# EasyEDA Pro project ProPrj_Ozealis_2025-07-08.epro, schematic Schematic1
Board Name: Board1; Create Date: 2025-06-20; Page Name: P1; Project Name: Ozealis; Schematic Name: Schematic1; Update Date: 2025-06-23; Company: EasyEDA.com; Page Size: A4; Version: V1.0
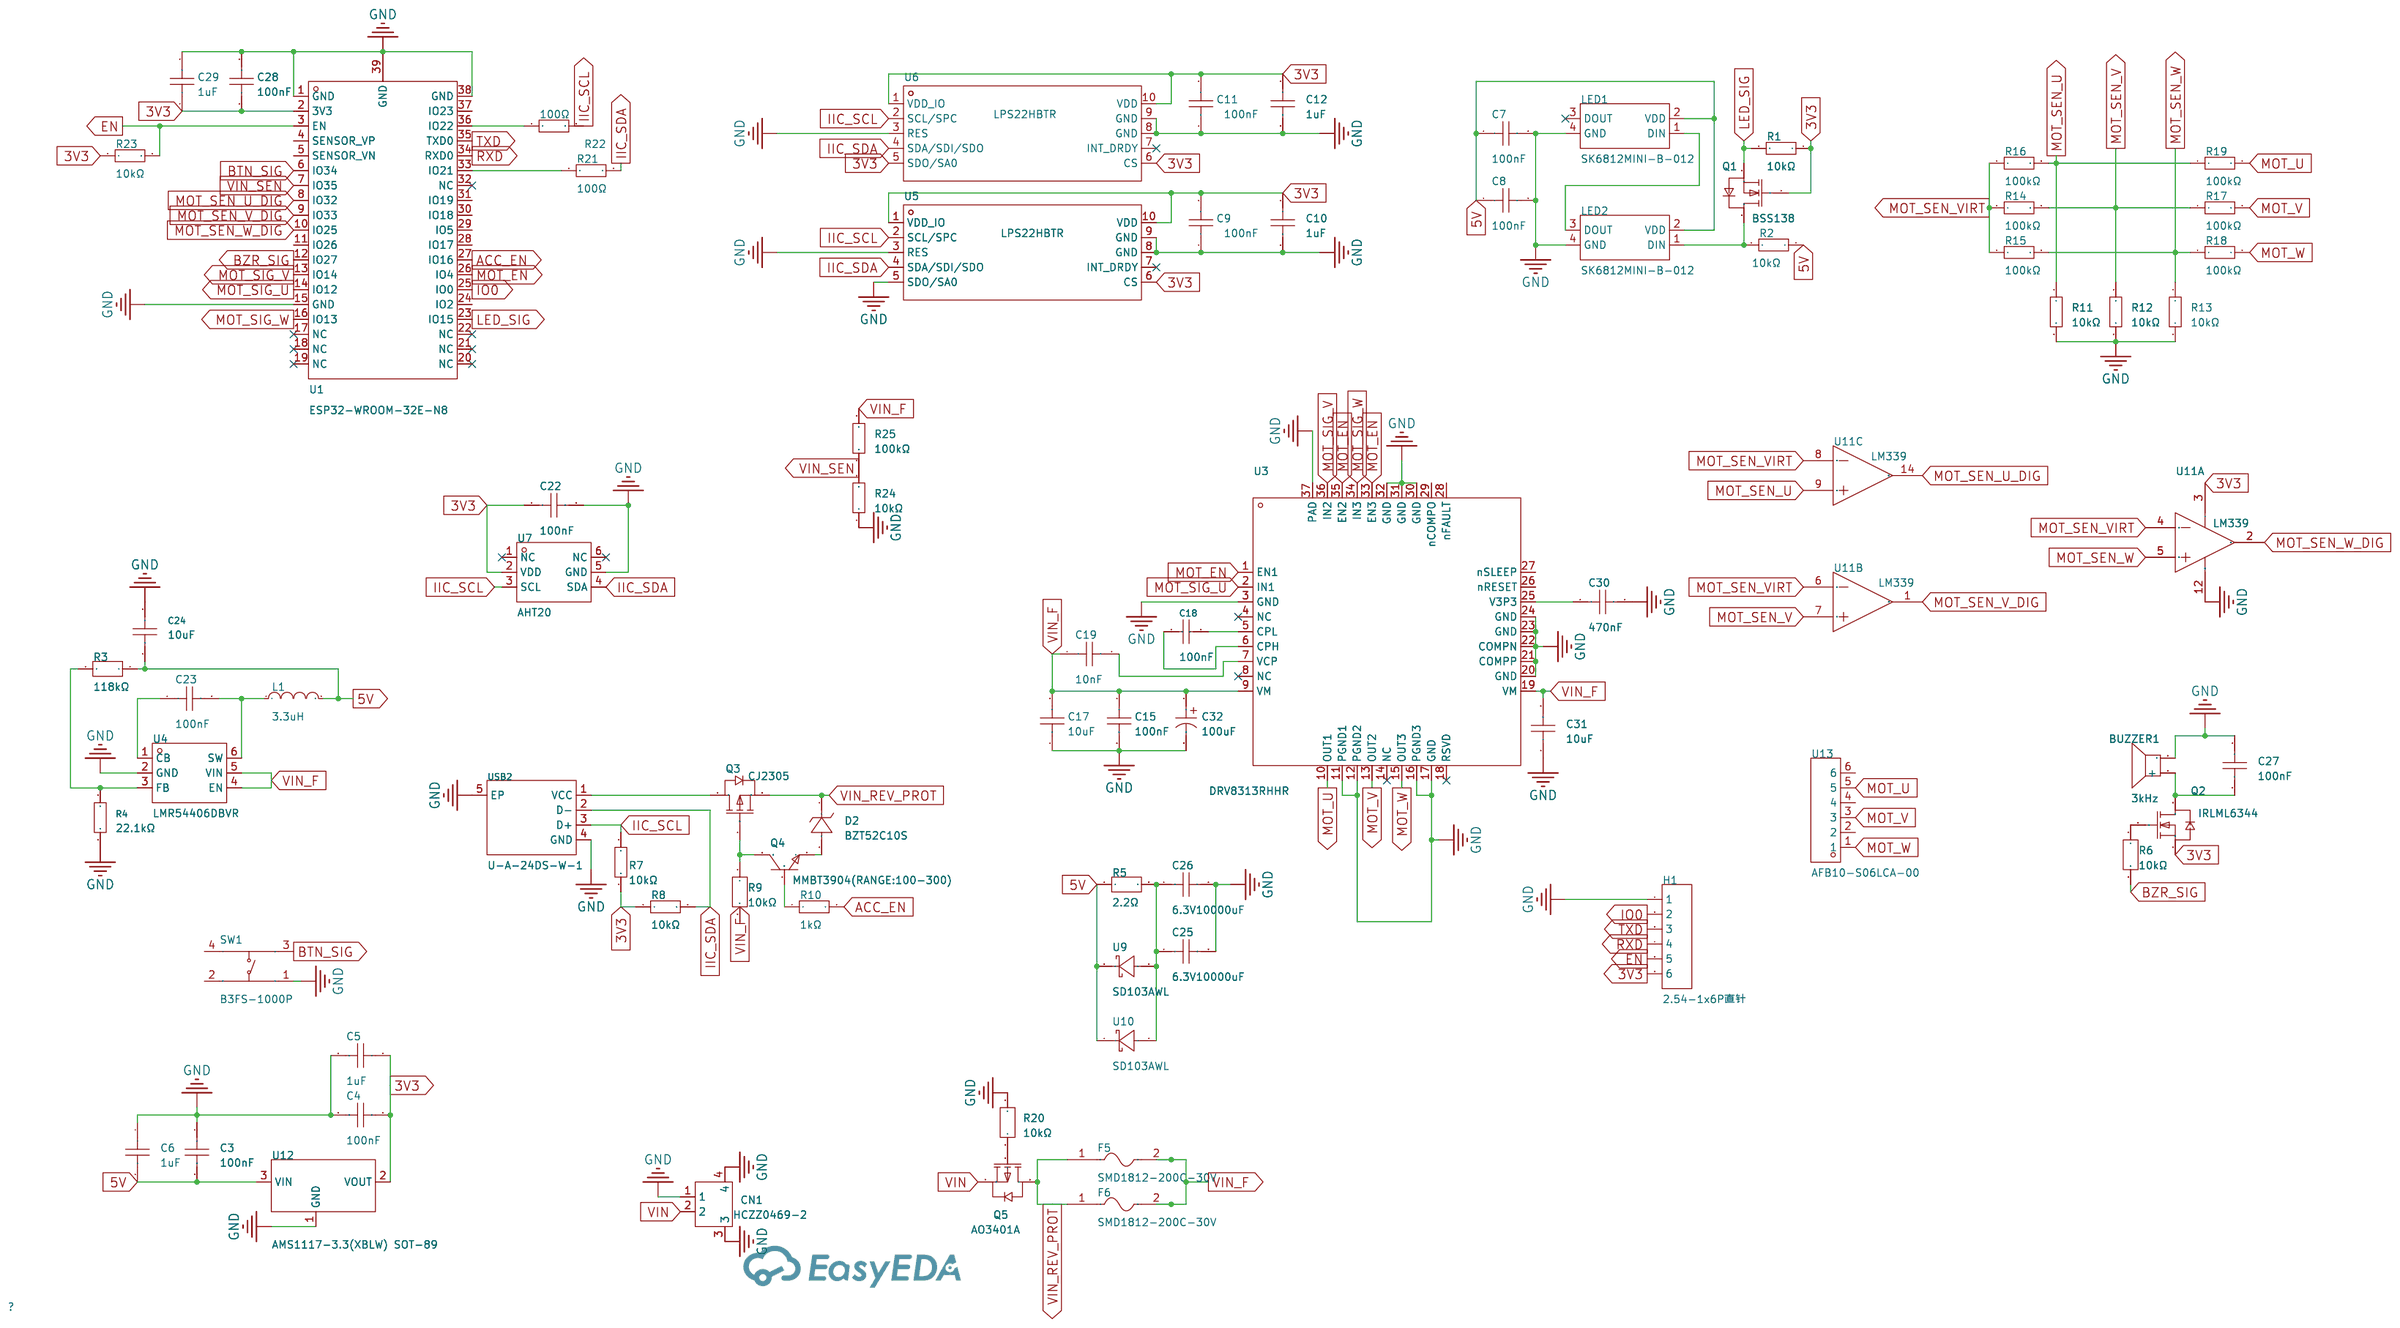
[diagram p0: schematic sheet]

## Parts
BUZZER1  3kHz  [BUZ-SMD_L9.6-W9.6-LS10.0-R]
C3  100nF  [C0603]
C4  100nF  [C0603]
C5  1uF  [C0603]
C6  1uF  [C0603]
C7  100nF  [C0603]
C8  100nF  [C0603]
C9  100nF  [C0603]
C10  1uF  [C0603]
C11  100nF  [C0603]
C12  1uF  [C0603]
C15  100nF  [C0603]
C17  10uF  [C0805]
C18  100nF  [C0603]
C19  10nF  [C0603]
C22  100nF  [C0603]
C23  100nF  [C0603]
C24  10uF  [C0603]
C25  6.3V10000uF  [PolCap_16x25mm]
C26  6.3V10000uF  [PolCap_16x25mm]
C27  100nF  [C0603]
C28  100nF  [C0603]
C29  1uF  [C0603]
C30  470nF  [C0603]
C31  10uF  [C0805]
C32  100uF  [CAP-SMD_BD6.3-L6.6-W6.6-LS7.4-FD]
CN1  HCZZ0469-2  [CONN-SMD_2P-P2.00_HCZZ0469-2]
D2  BZT52C10S  [SOD-323_L1.7-W1.3-LS2.6-RD]
F5  SMD1812-200C-30V  [F1812]
F6  SMD1812-200C-30V  [F1812]
H1  2.54-1x6P直针  [HDR-TH_6P-P2.54-V-M-1]
L1  3.3uH  [IND-SMD_L3.0-W3.0_FNR30XXS]
LED1  SK6812MINI-B-012  [LED-SMD_4P-L3.5-W3.5-R-SK6812MINI]
LED2  SK6812MINI-B-012  [LED-SMD_4P-L3.5-W3.5-R-SK6812MINI]
Q1  BSS138  [SOT-23-3_L2.9-W1.3-P1.90-LS2.4-BR-1]
Q2  IRLML6344  [SOT-23-3_L3.0-W1.7-P0.95-LS2.9-BR]
Q3  CJ2305  [SOT-23-3_L2.9-W1.3-P1.90-LS2.4-BR]
Q4  MMBT3904(RANGE:100-300)  [SOT-23-3_L2.9-W1.3-P1.90-LS2.4-BR]
Q5  AO3401A  [SOT-23_L2.9-W1.3-P1.90-LS2.4-BR]
R1  10kΩ  [R0603]
R2  10kΩ  [R0603]
R3  118kΩ  [R0402]
R4  22.1kΩ  [R0402]
R5  2.2Ω  [R0603]
R6  10kΩ  [R0603]
R7  10kΩ  [R0603]
R8  10kΩ  [R0603]
R9  10kΩ  [R0603]
R10  1kΩ  [R0603]
R11  10kΩ  [R0603]
R12  10kΩ  [R0603]
R13  10kΩ  [R0603]
R14  100kΩ  [R0603]
R15  100kΩ  [R0603]
R16  100kΩ  [R0603]
R17  100kΩ  [R0603]
R18  100kΩ  [R0603]
R19  100kΩ  [R0603]
R20  10kΩ  [R0603]
R21  100Ω  [R0603]
R22  100Ω  [R0603]
R23  10kΩ  [R0603]
R24  10kΩ  [R0603]
R25  100kΩ  [R0603]
SW1  B3FS-1000P  [KEY-SMD_4P-L6.0-W6.3-P4.50-LS8.0]
U1  ESP32-WROOM-32E-N8  [WIFI-SMD_ESP32-WROOM-32E]
U3  DRV8313RHHR  [VQFN-36_L6.0-W6.0-P0.50-TL-EP]
U4  LMR54406DBVR  [SOT-23-6_L2.9-W1.6-P0.95-LS2.8-BR]
U5  LPS22HBTR  [HLGA-10L_LPS22HBTR]
U6  LPS22HBTR  [HLGA-10L_LPS22HBTR]
U7  AHT20  [SENSOR-SMD_L3.0-W3.0-P1.00-BR]
U9  SD103AWL  [SOD-123FL_L2.8-W1.9-LS3.7-RD]
U10  SD103AWL  [SOD-123FL_L2.8-W1.9-LS3.7-RD]
U11  LM339  [SOIC-14_L8.7-W3.9-P1.27-LS6.0-BL]  (sections 1,2,3)
U12  AMS1117-3.3(XBLW) SOT-89  [SOT-89-3_L4.5-W2.5-P1.50-LS4.2-BR]
U13  AFB10-S06LCA-00  [FPC-SMD_6P-P1.00_AFB10-S6LCA-00]
USB2  U-A-24DS-W-1  [USB-A-SMD_U-A-24DS-W-1.]

## Library data of the parts
BUZZER1 = FUET-9650B-3V: Driver Circuitry:Active (Built-in Driver Circuit) Technology:Electromagnetic Type Voltage - Supply:2V~5V Voltage - Supply:2V~5V Frequency:3kHz Sound Pressure Level(SPL):85dB Length:9.6mm Width:9.6mm Height:5.5mm; LCSC Part Name: 电压 3V 频率 3KHZ; Supplier Part: C391032; Manufacturer: FUET(福声科技); Supplier Footprint: SMD,9.6x9.6mm; JLCPCB Part Class: Extended Part; Datasheet: https://atta.szlcsc.com/upload/public/pdf/source/20191031/C391032_DAAC75D3C9B9135EF0EA60697D179A21.pdf; Supplier: LCSC; Driver Circuitry: Active (Built-in Driver Circuit); Technology: Electromagnetic Type; Voltage - Supply: 2V~5V; Sound Pressure Level(SPL): 85dB; Length: 9.6mm; Width: 9.6mm; Height: 5.5mm
C3 C4 C7-C9 C11 C15 C18 C22 C23 C27 C28 = CC0603KRX7R9BB104: Capacitance:100nF Tolerance:±10% Tolerance:±10% Voltage Rating:50V Temperature Coefficient:X7R; LCSC Part Name: 100nF ±10% 50V; Supplier Part: C14663; Manufacturer: YAGEO(国巨); Supplier Footprint: 0603; JLCPCB Part Class: Basic Part; Datasheet: https://atta.szlcsc.com/upload/public/pdf/source/20180910/C282072_33301C7F631E79921B82A8DAC6BCC5B3.pdf; Supplier: LCSC; Tolerance: ±10%; Voltage Rating: 50V; Temperature Coefficient: X7R
C5 C6 C10 C12 C29 = CL10A105KB8NNNC: Capacitance: Tolerance:±10% Tolerance:±10% Voltage Rated: Temperature Coefficient:; LCSC Part Name: 1uF ±10% 50V; Supplier Part: C15849; Manufacturer: SAMSUNG(三星); Supplier Footprint: 0603; JLCPCB Part Class: Basic Part; Datasheet: https://atta.szlcsc.com/upload/public/pdf/source/20160218/1457707763339.pdf; Supplier: LCSC; Tolerance: ±10%
C17 C31 = GRM21BR61H106KE43L: Capacitance: Tolerance:±10% Tolerance:±10% Voltage Rated: Temperature Coefficient:; LCSC Part Name: 10uF ±10% 50V; Supplier Part: C440198; Manufacturer: muRata(村田); Supplier Footprint: 0805; JLCPCB Part Class: Basic Part; Datasheet: https://atta.szlcsc.com/upload/public/pdf/source/20230811/95AAE0C9AF55EDC31B7A4D8B733F534E.pdf; Supplier: LCSC; Tolerance: ±10%
C19 = 0603B103K500NT: Capacitance:10nF Tolerance:±10% Tolerance:±10% Voltage Rating:50V Temperature Coefficient:X7R; LCSC Part Name: 10nF ±10% 50V; Supplier Part: C57112; Manufacturer: FH(风华); Supplier Footprint: 0603; JLCPCB Part Class: Basic Part; Datasheet: https://atta.szlcsc.com/upload/public/pdf/source/20200305/C486355_26A10D38EF8C2A5C37091D0039909270.pdf; Supplier: LCSC; Tolerance: ±10%; Voltage Rating: 50V; Temperature Coefficient: X7R
C24 = TCC0603X5R106M6R3CT: Capacitance:10uF Tolerance:±20% Tolerance:±20% Voltage Rated: Temperature Coefficient:; LCSC Part Name: 10uF ±20% 6.3V; Supplier Part: C380318; Manufacturer: CCTC(三环); Supplier Footprint: 0603; JLCPCB Part Class: Extended Part; Datasheet: https://atta.szlcsc.com/upload/public/pdf/source/20191203/C466239_F62A586702D44EEA1C39B32FC8662B21.pdf; Supplier: LCSC; Tolerance: ±20%
C25 C26 = CAP_0603: Supplier Footprint: 0603
C30 = CL10B474KA8NNNC: Capacitance: Tolerance:±10% Tolerance:±10% Voltage Rated: Temperature Coefficient:; LCSC Part Name: 470nF ±10% 25V; Supplier Part: C1623; Manufacturer: SAMSUNG(三星); Supplier Footprint: 0603; JLCPCB Part Class: Basic Part; Datasheet: https://atta.szlcsc.com/upload/public/pdf/source/20160218/1457707763339.pdf; Supplier: LCSC; Tolerance: ±10%
C32 = RVT100UF35V67RV0034: Capacitance: Tolerance:±20% Tolerance:±20% Rated Voltage: Ripple Current:87mA@120kHz Equivalent Series Resistance(ESR):- φD: L: Lifetime @ Temp:2000hrs@105℃ Operating Temperature:-55℃~+105℃ Operating Temperature:-55℃~+105℃; LCSC Part Name: 100uF ±20% 35V; Supplier Part: C2836442; Manufacturer: KNSCHA(科尼盛); Supplier Footprint: SMD,D6.3xL7.7mm; JLCPCB Part Class: Extended Part; Datasheet: https://atta.szlcsc.com/upload/public/pdf/source/20210528/C2836442_7F6389BF36F63F32D6DF3A507E8E95D6.pdf; Supplier: LCSC; Tolerance: ±20%; Ripple Current: 87mA@120kHz; Lifetime @ Temp: 2000hrs@105℃; Operating Temperature: -55℃~+105℃
CN1 = HCZZ0469-2: Pins Structure:1x2P Pitch:2mm Mounting Type:Standing paste Reference Series:PH Number of Pins:2P Number of Rows:1 Number of PINs Per Row:2 Row Spacing:- Current Rating:- Contact Material:Copper Contact Plating:Tin Operating Temperature:-40℃~+85℃ Operating; LCSC Part Name: 米色 1x2P 间距:2mm 立贴加盖 系列:PH; Supplier Part: C7433663; Manufacturer: HC(虹成电子); Supplier Footprint: SMD,P=2mm; JLCPCB Part Class: Extended Part; Datasheet: https://atta.szlcsc.com/upload/public/pdf/source/20250106/BCCCD346ED2ED34F77424261D18F066D.pdf; Supplier: LCSC; Pins Structure: 1x2P; Pitch: 2mm; Mounting Type: Standing paste; Reference Series: PH; Number of Pins: 2P; Number of Rows: 1; Number of PINs Per Row: 2; Contact Material: Copper; Contact Plating: Tin; Operating Temperature: -40℃~+85℃; Voltage Rating: 200V; Plastic Material: LCP; Supplementary Features: Auxiliary soldering legs; Color: Beige; Z-Height of the Board: 6.8mm; X-Length of Bottom Edge on Board (Spacing Line): 8mm; Y-Width of Bottom Edge on Board: 7.45mm
D2 = BZT52C10S_C19077446: Diode Configuration:Independent Type Zener Voltage(Nom):10V Reverse Leakage Current (Ir):200nA@7V Zener Voltage(Range):9.4V~10.6V Zener Voltage(Range):9.4V~10.6V Pd - Power Dissipation(Pd):200mW Impedance(Zzt):20Ω; Supplier Part: C19077446; Manufacturer: 宏嘉诚; Supplier Footprint: SOD-323; JLCPCB Part Class: Extended Part; Datasheet: https://atta.szlcsc.com/upload/public/pdf/source/20250106/7E1D90346C4882705F28E5010261A625.pdf; Supplier: LCSC; Diode Configuration: Independent Type; Zener Voltage(Nom): 10V; Reverse Leakage Current (Ir): 200nA@7V; Zener Voltage(Range): 9.4V~10.6V; Pd - Power Dissipation(Pd): 200mW; Impedance(Zzt): 20Ω
F5 F6 = SMD1812-200C-30V: Voltage - Max:30V Current - Max:40A Hold Current:2A Trip Current:4A Power Dissipation:800mW Resistance - Initial (Ri) (Min):20mΩ Resistance - Post Trip (R1) (Max):120mΩ Time to Trip(Max):2s Operating Temperature:-40℃~+85℃ Operating Temperature:-40℃~+85℃; LCSC Part Name: 2A 30V; Supplier Part: C2760293; Manufacturer: BNstar(比诺星); Supplier Footprint: 1812; JLCPCB Part Class: Extended Part; Datasheet: https://atta.szlcsc.com/upload/public/pdf/source/20210406/C2760293_7ECBDC207E1EEA2298AB5DBB5FAFF113.pdf; Supplier: LCSC; Voltage - Max: 30V; Current - Max: 40A; Hold Current: 2A; Trip Current: 4A; Power Dissipation: 800mW; Resistance - Initial (Ri) (Min): 20mΩ; Resistance - Post Trip (R1) (Max): 120mΩ; Time to Trip(Max): 2s; Operating Temperature: -40℃~+85℃
H1 = 2.54-1x6P直针: Pin Structure:1x6P Pitch:2.54mm Row Spacing:- Circluar Pins/Square Pins:Policy Mounting Type:Straight Number of Rows:Single Row Number of Pins:6P Current Rating:3A Voltage Rating (Max):- Length of Mating Pin:- Insulation Height:- Contact Material:Brass Co; LCSC Part Name: 1x6P 间距:2.54mm 方针 直插; Supplier Part: C37208; Manufacturer: BOOMELE(博穆精密); Supplier Footprint: 插件,P=2.54mm; JLCPCB Part Class: Extended Part; Datasheet: https://atta.szlcsc.com/upload/public/pdf/source/20250115/42A019761A40C8B839643401D8CA5A96.pdf; Supplier: LCSC; Pin Structure: 1x6P; Pitch: 2.54mm; Circluar Pins/Square Pins: Policy; Mounting Type: Straight; Number of Rows: Single Row; Number of Pins: 6P; Current Rating: 3A; Contact Material: Brass; Operating Temperature: -40℃~+105℃; Color: Black
L1 = FNR3015S3R3MT: Inductance:3.3uH Tolerance:±20% Tolerance:±20% Current Rating:1.6A Current - Saturation(Isat):1.81A DC Resistance(DCR):104mΩ Type:Magnetic Core Shielded Winding Alloy Inductor; LCSC Part Name: 3.3uH ±20% 1.81A; Supplier Part: C167749; Manufacturer: cjiang(长江微电); Supplier Footprint: SMD,3x3mm; JLCPCB Part Class: Extended Part; Datasheet: https://atta.szlcsc.com/upload/public/pdf/source/20190327/C167925_9EFF0AABC4CA629C2CC95961DBF7D39D.pdf; Supplier: LCSC; Tolerance: ±20%; Current Rating: 1.6A; Current - Saturation(Isat): 1.81A; DC Resistance(DCR): 104mΩ; Type: Magnetic Core Shielded Winding Alloy Inductor
LED1 LED2 = SK6812MINI-B-012: Supplier Part: C5183448; Manufacturer: 欧思科光电; JLCPCB Part Class: Extended Part; Datasheet: https://atta.szlcsc.com/upload/public/pdf/source/20220921/A2A7EEE63CEE1C762C47FEA16B7D8FD1.pdf; Supplier: LCSC
Q1 = BSS138: Type:1 N-channel Drain Source Voltage (Vdss): Continuous Drain Current (Id): Drain Source On Resistance (RDS(on)@Vgs,Id):3.5Ω@4.5V,220mA Power Dissipation (Pd): Gate Threshold Voltage (Vgs(th)@Id):1.6V@1mA Total Gate Charge (Qg@Vgs):- Input Capacitance (C; LCSC Part Name: N沟道,电流:220mA,耐压:50V; Supplier Part: C3015220; Manufacturer: KUU; Supplier Footprint: SOT-23; JLCPCB Part Class: Extended Part; Datasheet: https://atta.szlcsc.com/upload/public/pdf/source/20220516/125DEF07DB3AB32C02C9AD402DEFFF8E.pdf; Supplier: LCSC; Type: 1 N-channel; Drain Source On Resistance (RDS(on)@Vgs,Id): 3.5Ω@4.5V,220mA; Gate Threshold Voltage (Vgs(th)@Id): 1.6V@1mA; Input Capacitance (Ciss@Vds): 50pF@25V; Operating Temperature: -55℃~+150℃
Q2 = IRLML6344: Type:1 N-channel Drain to Source Voltage:30V Current - Continuous Drain(Id):5A RDS(on):29mΩ@4.5V,5A Pd - Power Dissipation:1.3W Gate Threshold Voltage (Vgs(th)@Id):1.1V Gate Charge(Qg):6.8nC@4.5V Input Capacitance(Ciss@Vds):650pF@25V Reverse Transfer Capa; LCSC Part Name: 1个N沟道 耐压:30V 电流:5A; Supplier Part: C5364313; Manufacturer: Hottech(合科泰); Supplier Footprint: SOT-23; JLCPCB Part Class: Extended Part; Datasheet: https://atta.szlcsc.com/upload/public/pdf/source/20230301/8E25954CCFC2476B04CFE39BC51178A5.pdf; Supplier: LCSC; Type: 1 N-channel; Drain to Source Voltage: 30V; Current - Continuous Drain(Id): 5A; RDS(on): 29mΩ@4.5V,5A; Pd - Power Dissipation: 1.3W; Gate Threshold Voltage (Vgs(th)@Id): 1.1V; Gate Charge(Qg): 6.8nC@4.5V; Input Capacitance(Ciss@Vds): 650pF@25V; Reverse Transfer Capacitance (Crss@Vds): 46pF@15V; Operating Temperature: -55℃~+150℃
Q3 = CJ2305: Type:1 piece P-channel Drain to Source Voltage:12V Current - Continuous Drain(Id): RDS(on):90mΩ@1.8V,2A Pd - Power Dissipation:350mW Gate Threshold Voltage (Vgs(th)@Id):- Gate Charge(Qg):- Input Capacitance(Ciss@Vds):740pF@4V Reverse Transfer Capacitance; LCSC Part Name: 1个P沟道 耐压:12V 电流:4.1A; Supplier Part: C8549; Manufacturer: CJ(江苏长电/长晶); Supplier Footprint: SOT-23; JLCPCB Part Class: Extended Part; Datasheet: https://atta.szlcsc.com/upload/public/pdf/source/20161104/1478252660068.pdf; Supplier: LCSC; Type: 1 piece P-channel; Drain to Source Voltage: 12V; RDS(on): 90mΩ@1.8V,2A; Pd - Power Dissipation: 350mW; Input Capacitance(Ciss@Vds): 740pF@4V; Reverse Transfer Capacitance (Crss@Vds): 190pF@4V; Operating Temperature: -50℃~+150℃
Q4 = MMBT3904(RANGE:100-300): type:NPN Current - Collector(Ic): Collector - Emitter Voltage VCEO:40V Pd - Power Dissipation:200mW DC Current Gain:100@10mA,1V DC Current Gain:100@10mA,1V Transition frequency(fT):300MHz Current - Collector Cutoff:100nA Vce Saturation(VCE(sat)):300mV Ope; LCSC Part Name: hfe=100~300; Supplier Part: C20526; Manufacturer: CJ(江苏长电/长晶); Supplier Footprint: SOT-23; JLCPCB Part Class: Basic Part; Datasheet: https://atta.szlcsc.com/upload/public/pdf/source/20220704/70F575FB75061E03F919270A6BB8BA7F.pdf; Supplier: LCSC; type: NPN; Collector - Emitter Voltage VCEO: 40V; Pd - Power Dissipation: 200mW; DC Current Gain: 100@10mA,1V; Transition frequency(fT): 300MHz; Current - Collector Cutoff: 100nA; Vce Saturation(VCE(sat)): 300mV
Q5 = AO3401A_C347476: Type:1 Piece P-Channel Drain Source Voltage (Vdss): Continuous Drain Current (Id): Drain Source On Resistance (RDS(on)@Vgs,Id):50mΩ@10V Power Dissipation (Pd): Gate Threshold Voltage (Vgs(th)@Id):400mV@250uA Total Gate Charge (Qg@Vgs):9.4nC@4.5V Input Cap; LCSC Part Name: 1个P沟道 耐压:30V 电流:4.2A; Supplier Part: C347476; Manufacturer: UMW(友台半导体); Supplier Footprint: SOT-23; JLCPCB Part Class: Extended Part; Datasheet: https://atta.szlcsc.com/upload/public/pdf/source/20231109/42F312EBB081D72F04A7E8221BFFAF9D.pdf; Supplier: LCSC; Type: 1 Piece P-Channel; Drain Source On Resistance (RDS(on)@Vgs,Id): 50mΩ@10V; Gate Threshold Voltage (Vgs(th)@Id): 400mV@250uA; Total Gate Charge (Qg@Vgs): 9.4nC@4.5V; Input Capacitance (Ciss@Vds): 954pF; Reverse Transfer Capacitance (Crss@Vds): 77pF; Operating Temperature: -55℃~+150℃
R1 R2 R11-R13 = RC0603FR-0710KL: Type:Thick Film Resistors Resistance: Tolerance:±1% Tolerance:±1% Power(Watts): Overload Voltage (Max): Temperature Coefficient:±100ppm/℃ Temperature Coefficient:±100ppm/℃ Operating Temperature Range:-55℃~+155℃ Operating Temperature Range:-55℃~+155℃; LCSC Part Name: 厚膜电阻 10kΩ ±1% 100mW; Supplier Part: C98220; Manufacturer: YAGEO(国巨); Supplier Footprint: 0603; JLCPCB Part Class: Extended Part; Datasheet: https://atta.szlcsc.com/upload/public/pdf/source/20180927/C295883_E8D83085EA81BD7DE0B2B681138C15EE.pdf; Supplier: LCSC; Type: Thick Film Resistors; Tolerance: ±1%; Temperature Coefficient: ±100ppm/℃; Operating Temperature Range: -55℃~+155℃
R3 = RC0402FR-07118KL: Type:Thick Film Resistors Resistance: Tolerance:±1% Tolerance:±1% Power(Watts): Overload Voltage (Max): Temperature Coefficient:±100ppm/℃ Temperature Coefficient:±100ppm/℃ Operating Temperature Range:-55℃~+155℃ Operating Temperature Range:-55℃~+155℃; LCSC Part Name: 厚膜电阻 118kΩ ±1% 62.5mW; Supplier Part: C295873; Manufacturer: YAGEO(国巨); Supplier Footprint: 0402; JLCPCB Part Class: Extended Part; Datasheet: https://atta.szlcsc.com/upload/public/pdf/source/20191125/C364360_EA870FADD46A2AD4DBE56DD50D360B3E.pdf; Supplier: LCSC; Type: Thick Film Resistors; Tolerance: ±1%; Temperature Coefficient: ±100ppm/℃; Operating Temperature Range: -55℃~+155℃
R4 = RMC040222.1K1%N: Resistance: Tolerance:±1% Tolerance:±1% Power(Watts):; LCSC Part Name: 22.1kΩ ±1% 62.5mW; Supplier Part: C325588; Manufacturer: Tyohm(幸亚电阻); Supplier Footprint: 0402; JLCPCB Part Class: Extended Part; Datasheet: https://atta.szlcsc.com/upload/public/pdf/source/20190115/C325956_D27151D492FFB3C9AB4A6F14FE01F30A.pdf; Supplier: LCSC; Tolerance: ±1%
R5 = FRC0603J2R2TS: Type:Thick Film Resistors Resistance: Tolerance:±5% Tolerance:±5% Power(Watts): Overload Voltage (Max): Temperature Coefficient:±200ppm/℃ Temperature Coefficient:±200ppm/℃ Operating Temperature Range:-55℃~+155℃ Operating Temperature Range:-55℃~+155℃; LCSC Part Name: 2.2Ω ±5% 100mW 厚膜电阻; Supplier Part: C2930032; Manufacturer: FOJAN(富捷); Supplier Footprint: 0603; JLCPCB Part Class: Extended Part; Datasheet: https://atta.szlcsc.com/upload/public/pdf/source/20211221/925EC7D7225764EE0046F22065062C87.pdf; Supplier: LCSC; Type: Thick Film Resistors; Tolerance: ±5%; Temperature Coefficient: ±200ppm/℃; Operating Temperature Range: -55℃~+155℃
R6-R9 R20 R23 R24 = FRC0603J103 TS: Type:Thick Film Resistors Resistance:10kΩ Tolerance:±5% Tolerance:±5% Power(Watts):0.1W Voltage-Supply(Max):75V Temperature Coefficient:±100ppm/℃ Temperature Coefficient:±100ppm/℃ Operating Temperature:-55℃~+155℃ Operating Temperature:-55℃~+155℃; LCSC Part Name: 10kΩ ±5% 100mW 厚膜电阻; Supplier Part: C2930027; Manufacturer: FOJAN(富捷); Supplier Footprint: 0603; JLCPCB Part Class: Extended Part; Datasheet: https://atta.szlcsc.com/upload/public/pdf/source/20211221/925EC7D7225764EE0046F22065062C87.pdf; Supplier: LCSC; Type: Thick Film Resistors; Tolerance: ±5%; Power(Watts): 0.1W; Voltage-Supply(Max): 75V; Temperature Coefficient: ±100ppm/℃; Operating Temperature: -55℃~+155℃
R10 = 0603WAF1001T5E: Type:Thick Film Resistors Resistance:1kΩ Tolerance:±1% Tolerance:±1% Power(Watts): Overload Voltage (Max): Temperature Coefficient:±100ppm/℃ Temperature Coefficient:±100ppm/℃ Operating Temperature Range:-55℃~+155℃ Operating Temperature Range:-55℃~+155℃; LCSC Part Name: 1kΩ ±1% 100mW 厚膜电阻; Supplier Part: C21190; Manufacturer: UNI-ROYAL(厚声); Supplier Footprint: 0603; JLCPCB Part Class: Basic Part; Datasheet: https://atta.szlcsc.com/upload/public/pdf/source/20200306/C422600_1E6D84923E4A46A82E41ADD87F860B5C.pdf; Supplier: LCSC; Type: Thick Film Resistors; Tolerance: ±1%; Temperature Coefficient: ±100ppm/℃; Operating Temperature Range: -55℃~+155℃
R14-R19 R25 = 0603WAF1003T5E: Type:Thick Film Resistors Resistance:100kΩ Tolerance:±1% Tolerance:±1% Power(Watts): Overload Voltage (Max): Temperature Coefficient:±100ppm/℃ Temperature Coefficient:±100ppm/℃ Operating Temperature Range:-55℃~+155℃ Operating Temperature Range:-55℃~+155℃; LCSC Part Name: 100kΩ ±1% 100mW 厚膜电阻; Supplier Part: C25803; Manufacturer: UNI-ROYAL(厚声); Supplier Footprint: 0603; JLCPCB Part Class: Basic Part; Datasheet: https://atta.szlcsc.com/upload/public/pdf/source/20200306/C422600_1E6D84923E4A46A82E41ADD87F860B5C.pdf; Supplier: LCSC; Type: Thick Film Resistors; Tolerance: ±1%; Temperature Coefficient: ±100ppm/℃; Operating Temperature Range: -55℃~+155℃
R21 R22 = 0603WAF1000T5E: Type:Thick Film Resistors Resistance: Tolerance:±1% Tolerance:±1% Power(Watts): Overload Voltage (Max): Temperature Coefficient:±200ppm/℃ Temperature Coefficient:±200ppm/℃ Operating Temperature Range:-55℃~+155℃ Operating Temperature Range:-55℃~+155℃; LCSC Part Name: 100Ω ±1% 100mW 厚膜电阻; Supplier Part: C22775; Manufacturer: UNI-ROYAL(厚声); Supplier Footprint: 0603; JLCPCB Part Class: Basic Part; Datasheet: https://atta.szlcsc.com/upload/public/pdf/source/20200306/C422600_1E6D84923E4A46A82E41ADD87F860B5C.pdf; Supplier: LCSC; Type: Thick Film Resistors; Tolerance: ±1%; Temperature Coefficient: ±200ppm/℃; Operating Temperature Range: -55℃~+155℃
SW1 = B3FS-1000P: Circuit:SPST Actuator Style:Round Button Operating Force:100gf Mounting Style:Standing paste Switch Length:6.3mm Switch Width:6mm Switch Height:3.1mm Contact Current:50mA Voltage Rating (DC):24V With Lamp:- Pin Style:Gullwing Mechanical Life:- Operating T; LCSC Part Name: 6.3*6*3.1mm 立贴 轻触开关; Supplier Part: C271750; Manufacturer: OMRON(欧姆龙); Supplier Footprint: SMD,6x6mm; JLCPCB Part Class: Extended Part; Supplier: LCSC; Circuit: SPST; Actuator Style: Round Button; Operating Force: 100gf; Mounting Style: Standing paste; Switch Length: 6.3mm; Switch Width: 6mm; Switch Height: 3.1mm; Contact Current: 50mA; Voltage Rating (DC): 24V; Pin Style: Gullwing; Operating Temperature: -25℃~+70℃
U1 = ESP32-WROOM-32E-N8: LCSC Part Name: 通用型Wi-Fi+BT+BLE MCU模组; Supplier Part: C701342; Manufacturer: ESPRESSIF(乐鑫); Supplier Footprint: SMD,18x25.5mm; JLCPCB Part Class: Extended Part; Datasheet: https://atta.szlcsc.com/upload/public/pdf/source/20240307/DEBA00FAE5BA634F0D73085E4F214E93.pdf; Supplier: LCSC
U3 = DRV8313RHHR: LCSC Part Name: 无刷直流BLDC电机驱动芯片 60V; Supplier Part: C165154; Manufacturer: TI(德州仪器); Supplier Footprint: VQFN-36-EP(6x6); JLCPCB Part Class: Extended Part; Datasheet: https://www.ti.com/cn/lit/gpn/drv8313; Supplier: LCSC
U4 = LMR54406DBVR: Function:Step-down type Output Type:Adjustable Input Voltage:4V~36V Input Voltage:4V~36V Output Voltage:1V~28V Output Voltage:1V~28V Output Current:600mA Switching Frequency:1265kHz Switching Frequency:1265kHz Operating Temperature:-40℃~+125℃ Operating Te; Supplier Part: C5219316; Manufacturer: TI(德州仪器); Supplier Footprint: SOT-23-6; JLCPCB Part Class: Extended Part; Datasheet: https://www.ti.com/cn/lit/gpn/lmr54410; Supplier: LCSC; Function: Step-down type; Output Type: Adjustable; Input Voltage: 4V~36V; Output Voltage: 1V~28V; Output Current: 600mA; Switching Frequency: 1265kHz; Operating Temperature: -40℃~+125℃; Synchronous Rectification: Yes; Number of Outputs: 1; Topology: Step-down; Quiescent Current (Iq): 80uA; Switch tube (built-in/external): Built-in
U5 U6 = LPS22HBTR: Pressure range:26Kpa~126Kpa Pressure range:26Kpa~126Kpa The Power Supply Voltage:1.7V~3.6V The Power Supply Voltage:1.7V~3.6V Operating Temperature:-40℃~+85℃ Operating Temperature:-40℃~+85℃; Supplier Part: C94049; Manufacturer: ST(意法半导体); Supplier Footprint: HLGA-10(2x2); JLCPCB Part Class: Extended Part; Datasheet: https://atta.szlcsc.com/upload/public/pdf/source/20170908/C94049_1504870171328958154.pdf; Supplier: LCSC; Pressure range: 26Kpa~126Kpa; The Power Supply Voltage: 1.7V~3.6V; Operating Temperature: -40℃~+85℃
U7 = AHT20: Supplier Part: C2757850; Manufacturer: 广州奥松; Supplier Footprint: SMD; JLCPCB Part Class: Extended Part; Datasheet: https://atta.szlcsc.com/upload/public/pdf/source/20231023/00557B34ED120268320A4810FF8DED4D.pdf; Supplier: LCSC
U9 U10 = SD103AWL: Diode Configuration:Independent Type Voltage - Forward(Vf@If):600mV@0.2A Voltage - DC Reverse(Vr):40V Current - Rectified:350mA Reverse Leakage Current (Ir):50uA; LCSC Part Name: 电压:40V 电流:350mA; Supplier Part: C22399516; Manufacturer: GOODWORK(固得沃克); Supplier Footprint: SOD-123FL; JLCPCB Part Class: Extended Part; Datasheet: https://atta.szlcsc.com/upload/public/pdf/source/20240513/24F03F05AD9158C22A497BED70B532D6.pdf; Supplier: LCSC; Diode Configuration: Independent Type; Voltage - Forward(Vf@If): 600mV@0.2A; Voltage - DC Reverse(Vr): 40V; Current - Rectified: 350mA; Reverse Leakage Current (Ir): 50uA
U11 = LM339_C5456631: Number of Channels:QUAD Vos - Input Offset Voltage:1.5mV Ib - Input Bias Current:57nA Propagation Delay Time:- Common Mode Rejection Ratio(CMRR):- Voltage - Supply:2V~32V Voltage - Supply:2V~32V Output Type:- Output Type:DTL；TTL；CMOS Quiescent Current per; LCSC Part Name: 四路差动比较器; Supplier Part: C5456631; Manufacturer: JSMSEMI(杰盛微); Supplier Footprint: SOP-14; JLCPCB Part Class: Extended Part; Datasheet: https://atta.szlcsc.com/upload/public/pdf/source/20230621/6ABF84A51ED3F32FD0875A9D9868A524.pdf; Supplier: LCSC; Number of Channels: QUAD; Vos - Input Offset Voltage: 1.5mV; Ib - Input Bias Current: 57nA; Voltage - Supply: 2V~32V; Output Type: DTL；TTL；CMOS; Quiescent Current per Amplifier: 1.1mA; Operating Temperature: 0℃~+70℃
U12 = AMS1117-3.3(XBLW) SOT-89: Output Type:Fixed Voltage - Supply:15V Output Voltage:3.3V Output Voltage:3.3V Output Current:1A Voltage Dropout:1.3V standby current:- Features:Overheat protection；Overcurrent Protection Operating Temperature:-40℃~+125℃ Operating Temperature:-40℃~+125℃ O; LCSC Part Name: AMS1117-3.3; Supplier Part: C18723569; Manufacturer: XBLW(芯伯乐); Supplier Footprint: SOT-89; JLCPCB Part Class: Extended Part; Datasheet: https://atta.szlcsc.com/upload/public/pdf/source/20240808/7EFE41334E3FB6443A50F8A6E514CAA0.pdf; Supplier: LCSC; Output Type: Fixed; Voltage - Supply: 15V; Output Voltage: 3.3V; Output Current: 1A; Voltage Dropout: 1.3V; Features: Overheat protection；Overcurrent Protection; Operating Temperature: -40℃~+125℃; Output Configuration: Positive electrode; Number of Outputs: 1; Check: false
U13 = AFB10-S06LCA-00: Locking Feature:No lock Contact Type:Single-sided contact points/Vertical Number of Contacts:6P Pitch:1mm Mounting Type:Standing paste Operating Temperature Range:-20℃~+80℃ Operating Temperature Range:-20℃~+80℃; Supplier Part: C7499263; Manufacturer: JS(钜硕电子); Supplier Footprint: SMD,P=1.0mm; JLCPCB Part Class: Extended Part; Datasheet: https://atta.szlcsc.com/upload/public/pdf/source/20211022/8615908AB19D901CCBB4AC92EC506F13.pdf; Supplier: LCSC; Locking Feature: No lock; Contact Type: Single-sided contact points/Vertical; Number of Contacts: 6P; Pitch: 1mm; Mounting Type: Standing paste; Operating Temperature Range: -20℃~+80℃
USB2 = U-A-24DS-W-1: Connector Type:Type-A Standard:USB 2.0 Gender:Female Number of Ports:1 Number of Contacts:4P Mounting Style:Sink board Current Rating - Power (Max):1.5A Operating Temperature Range:-40℃~+85℃ Operating Temperature Range:-40℃~+85℃; LCSC Part Name: Type-A 母 沉板; Supplier Part: C530628; Manufacturer: 韩国韩荣; Supplier Footprint: SMD; JLCPCB Part Class: Extended Part; Datasheet: https://atta.szlcsc.com/upload/public/pdf/source/20210810/2C067F99869714CFB9CFA9CD362C588E.pdf; Supplier: LCSC; Connector Type: Type-A; Standard: USB 2.0; Gender: Female; Number of Ports: 1; Number of Contacts: 4P; Mounting Style: Sink board; Current Rating - Power (Max): 1.5A; Operating Temperature Range: -40℃~+85℃; Check: false

## Nets
3V3: C4.1 C5.1 C9.2 C10.1 C11.2 C12.1 C22.1 C28.1 C29.1 H1.6 Q1.1(G) Q2.2(S) R1.1 R7.1 R8.1 R23.1 U1.2(3V3) U5.1(VDD_IO) U5.6(CS) U5.10(VDD) U6.1(VDD_IO) U6.5(SDO/SA0) U6.6(CS) U6.10(VDD) U7.2(VDD) U11.3(V+) U12.2(VOUT)
5V: C3.2 C6.2 C7.1 C8.1 C24.1 L1.2 LED1.2(VDD) LED2.2(VDD) R2.1 R3.1 R5.1 U9.1(K) U10.1(K) U12.3(VIN)
GND: BUZZER1.2 C3.1 C4.2 C5.2 C6.1 C7.2 C8.2 C9.1 C10.2 C11.1 C12.2 C15.2 C17.1 C22.2 C24.2 C25.2 C26.2 C27.1 C28.2 C29.2 C30.2 C31.1 C32.2 CN1.1 CN1.3 CN1.4 H1.1 LED1.4(GND) LED2.4(GND) R4.1 R11.2 R12.2 R13.2 R20.2 R24.1 SW1.1 U1.1(GND) U1.15(GND) U1.38(GND) U1.39(GND) U3.3(GND) U3.11(PGND1) U3.12(PGND2) U3.16(PGND3) U3.17(GND) U3.20(GND) U3.21(COMPP) U3.22(COMPN) U3.23(GND) U3.24(GND) U3.30(GND) U3.31(GND) U3.32(GND) U3.37(PAD) U4.2(GND) U5.3(RES) U5.5(SDO/SA0) U5.8(GND) U5.9(GND) U6.3(RES) U6.8(GND) U6.9(GND) U7.5(GND) U11.12(GND) U12.1(GND) USB2.4(GND) USB2.5(EP)
VIN: CN1.2 Q5.2(S)
VIN_F: C15.1 C17.2 C19.1 C31.2 C32.1 F5.2 F6.2 R9.2 R25.2 U3.9(VM) U3.19(VM) U4.4(EN) U4.5(VIN)
VIN_REV_PROT: D2.1(K) F5.1 F6.1 Q3.2(S) Q5.3(D)
VIN_SEN: R24.2 R25.1 U1.7(IO35)
ACC_EN: R10.2 U1.27(IO16)
BTN_SIG: SW1.3 U1.6(IO34)
BZR_SIG: R6.1 U1.12(IO27)
EN: H1.5 R23.2 U1.3(EN)
IIC_SCL: R7.2 R22.2 U5.2(SCL/SPC) U6.2(SCL/SPC) U7.3(SCL) USB2.3(D+)
IIC_SDA: R8.2 R21.2 U5.4(SDA/SDI/SDO) U6.4(SDA/SDI/SDO) U7.4(SDA) USB2.2(D-)
IO0: H1.2 U1.25(IO0)
LED_SIG: Q1.2(S) R1.2 U1.23(IO15)
MOT_EN: U1.26(IO4) U3.1(EN1) U3.33(EN3) U3.35(EN2)
MOT_SEN_U: R11.1 R16.2 R19.1 U11.9(IN3+)
MOT_SEN_U_DIG: U1.8(IO32) U11.14(OUT3)
MOT_SEN_V: R12.1 R14.2 R17.1 U11.7(IN2+)
MOT_SEN_V_DIG: U1.9(IO33) U11.1(OUT2)
MOT_SEN_VIRT: R14.1 R15.1 R16.1 U11.4(IN1-) U11.6(IN2-) U11.8(IN3-)
MOT_SEN_W: R13.1 R15.2 R18.1 U11.5(IN1+)
MOT_SEN_W_DIG: U1.10(IO25) U11.2(OUT1)
MOT_SIG_U: U1.14(IO12) U3.2(IN1)
MOT_SIG_V: U1.13(IO14) U3.36(IN2)
MOT_SIG_W: U1.16(IO13) U3.34(IN3)
MOT_U: R19.2 U3.10(OUT1) U13.5
MOT_V: R17.2 U3.13(OUT2) U13.3
MOT_W: R18.2 U3.15(OUT3) U13.1
RXD: H1.4 U1.34(RXD0)
TXD: H1.3 U1.35(TXD0)
$1N3010: LED2.1(DIN) Q1.3(D) R2.2
$1N3107: LED1.1(DIN) LED2.3(DOUT)
$1N4556: C18.2 U3.5(CPL)
$1N4560: C18.1 U3.6(CPH)
$1N4648: C19.2 U3.7(VCP)
$1N5984: C30.1 U3.25(V3P3)
$1N6530: R3.2 R4.2 U4.3(FB)
$1N6654: C23.1 U4.1(CB)
$1N6821: C23.2 L1.1 U4.6(SW)
$1N7425: C25.1 C26.1 R5.2 U9.2(A) U10.2(A)
$1N7619: BUZZER1.1(+) C27.2 Q2.3(D)
$1N7703: Q2.1(G) R6.2
$1N9249: Q3.3(D) USB2.1(VCC)
$1N11310: Q4.1(B) R10.1
$1N11461: Q3.1(G) Q4.3(C) R9.1
$1N21787: Q5.1(G) R20.1
$1N22073: D2.2(A) Q4.2(E)
$1N24692: R21.1 U1.33(IO21)
$1N24734: R22.1 U1.36(IO22)

Not connected (* = marked no-connect by the designer): LED1 3(DOUT)*; SW1 2 4; U1 4(SENSOR_VP) 5(SENSOR_VN) 11(IO26) 17(NC)* 18(NC)* 19(NC)* 20(NC)* 21(NC)* 22(NC)* 24(IO2) 28(IO17) 29(IO5) 30(IO18) 31(IO19) 32(NC)* 37(IO23); U3 4(NC)* 8(NC)* 14(NC)* 18(RSVD)* 26(nRESET) 27(nSLEEP) 28(nFAULT) 29(nCOMPO); U5 7(INT_DRDY)*; U6 7(INT_DRDY)*; U7 1(NC)* 6(NC)*; U13 2 4 6
